# Altium schematic sheet Analog.SchDoc
size A4
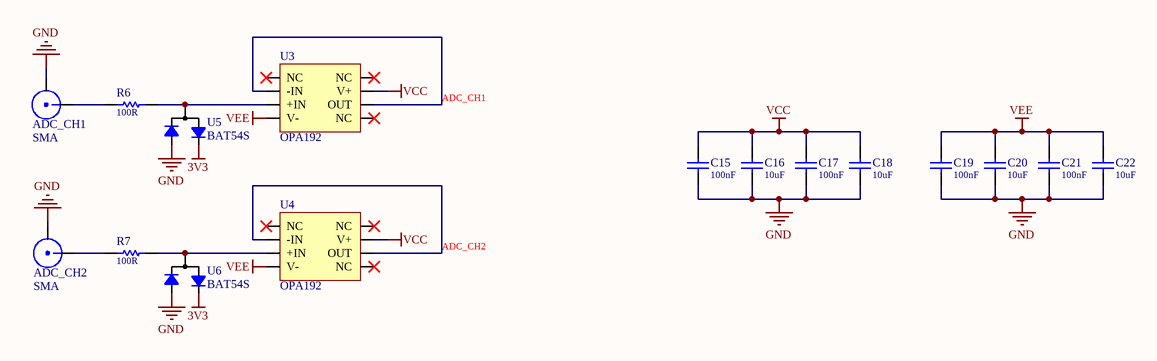
[diagram p0: Analog.SchDoc]

## Parts
ADC_CH1  SMA  [SMA1]
ADC_CH2  SMA  [SMA1]
C15  value 100nF  [C0603-L]  (hidden comment: Cap-S)
C16  value 10uF  [C0603-L]  (hidden comment: Cap-S)
C17  value 100nF  [C0603-L]  (hidden comment: Cap-S)
C18  value 10uF  [C0603-L]  (hidden comment: Cap-S)
C19  value 100nF  [C0603-L]  (hidden comment: Cap-S)
C20  value 10uF  [C0603-L]  (hidden comment: Cap-S)
C21  value 100nF  [C0603-L]  (hidden comment: Cap-S)
C22  value 10uF  [C0603-L]  (hidden comment: Cap-S)
R6  value 100R  [R0603-L]  (hidden comment: R)
R7  value 100R  [R0603-L]  (hidden comment: R)
U3  OPA192  [SOIC127P600X175-8N]
U4  OPA192  [SOIC127P600X175-8N]
U5  BAT54S  [SOT-23-3]
U6  BAT54S  [SOT-23-3]

## Nets
3V3: U5.3 U6.3
GND: ADC_CH1.2 ADC_CH2.2 C15.1 C16.1 C17.1 C18.1 C19.1 C20.1 C21.1 C22.1 U5.1 U6.1
VCC: C15.2 C16.2 C17.2 C18.2 U3.7(V+) U4.7(V+)
VEE: C19.2 C20.2 C21.2 C22.2 U3.4(V-) U4.4(V-)
ADC_CH1: U3.2(-IN) U3.6(OUT)
ADC_CH2: U4.2(-IN) U4.6(OUT)
NetADC_CH1_1: ADC_CH1.1 R6.1
NetADC_CH2_1: ADC_CH2.1 R7.1
NetR6_2: R6.2 U3.3(+IN) U5.2
NetR7_2: R7.2 U4.3(+IN) U6.2

Not connected (* = marked no-connect by the designer): U3 1(NC)* 5(NC)* 8(NC)*; U4 1(NC)* 5(NC)* 8(NC)*

## Library data of the parts
C15-C22 = Cap-S: 贴片瓷片电容
R6 R7 = Res: 贴片电阻